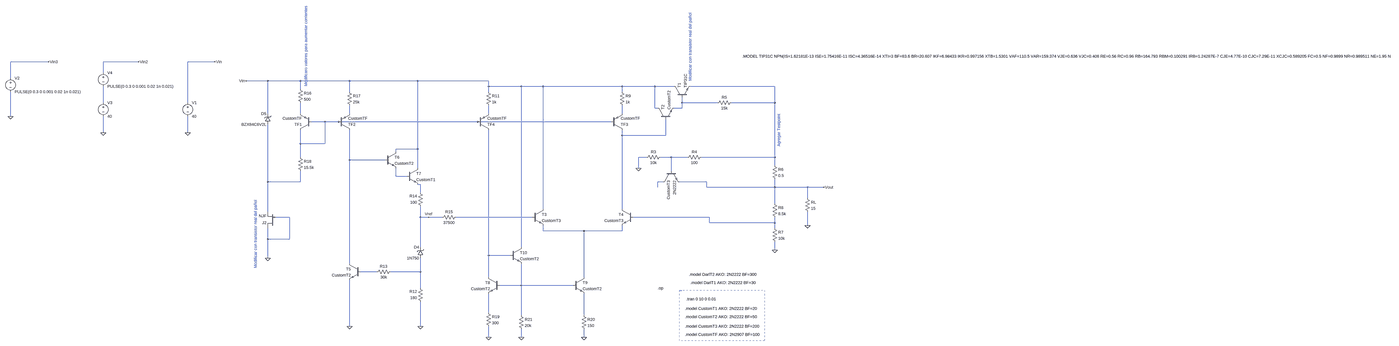
[diagram p0: schematic TP1_G6.asc, whole sheet]
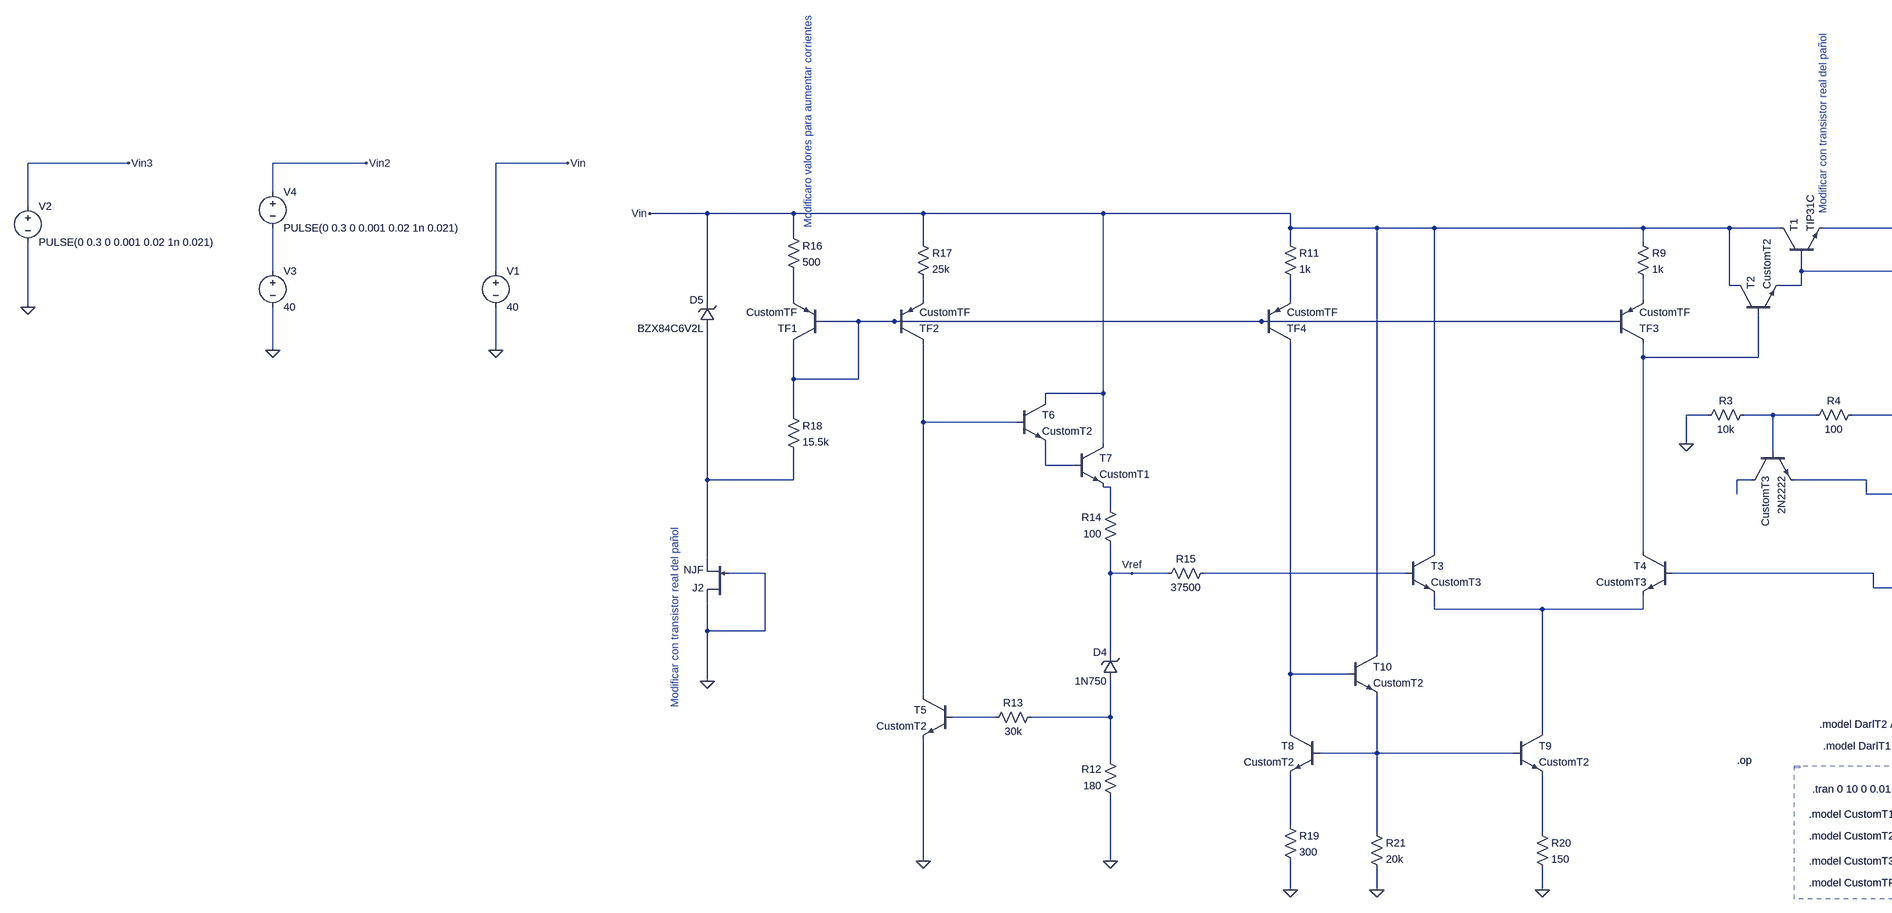
[diagram p1: schematic TP1_G6.asc, part, row 1 of 1, column 1 of 2]
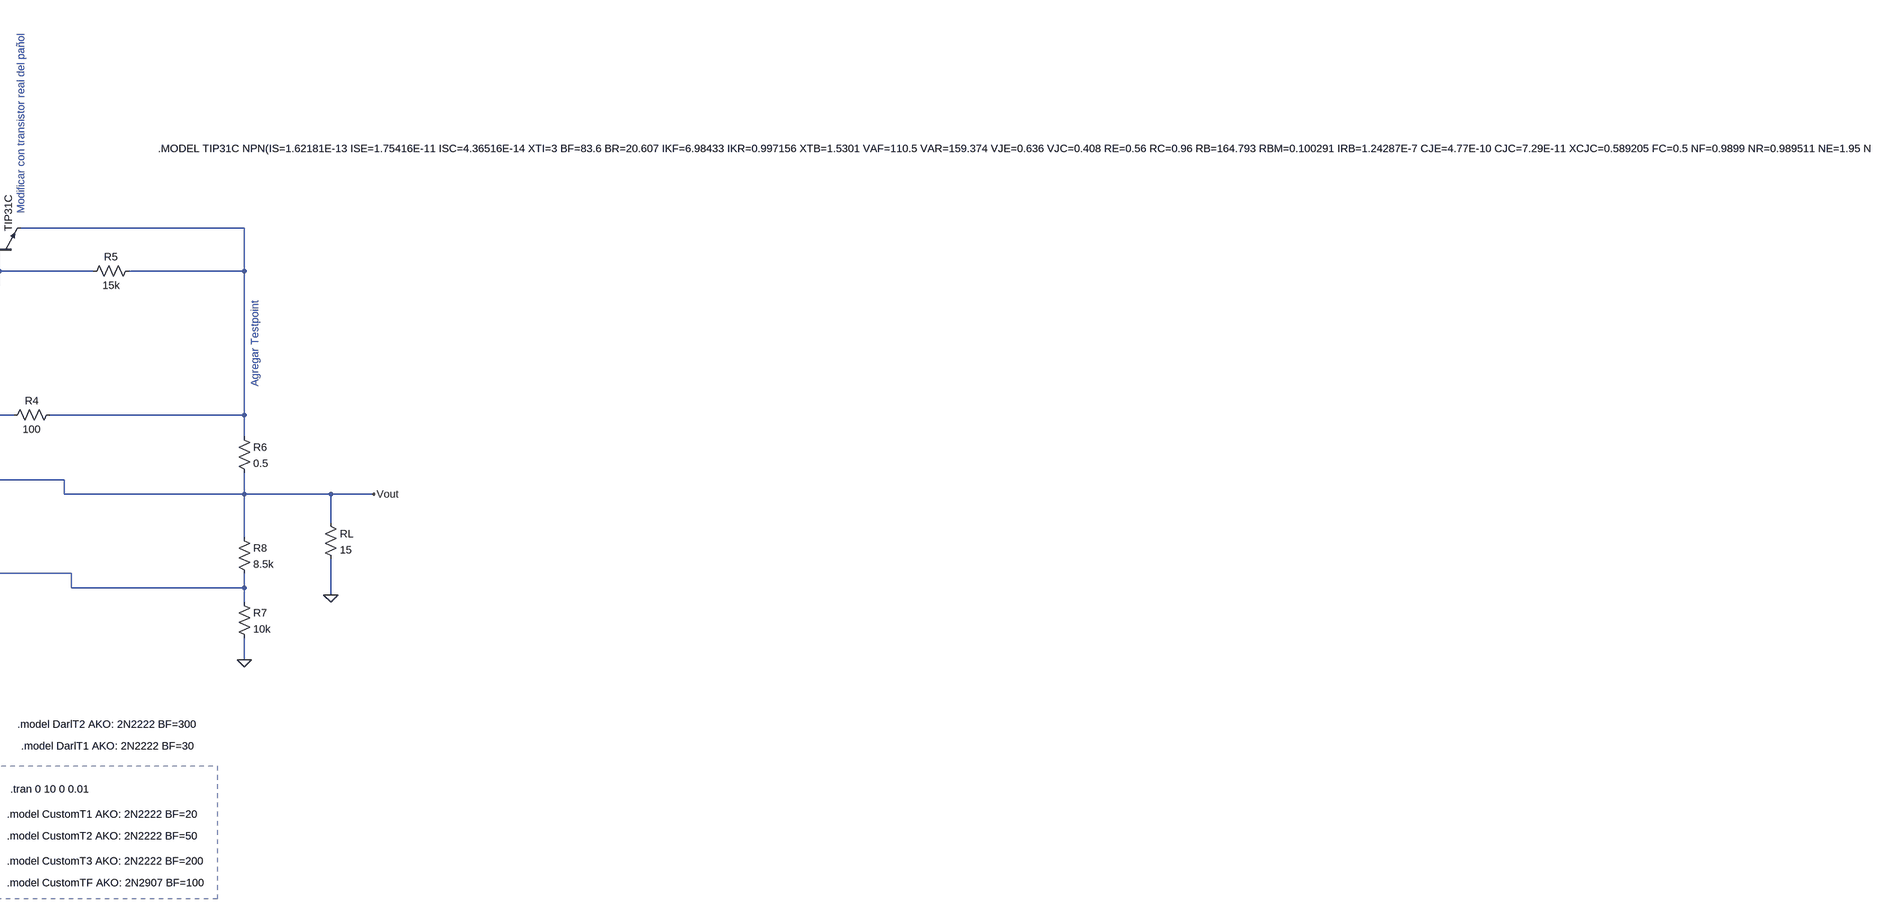
[diagram p2: schematic TP1_G6.asc, part, row 1 of 1, column 2 of 2]
TP1_G6.asc, the LTspice schematic file:
Version 4
SHEET 1 5960 1536
WIRE -3728 -224 -3952 -224
WIRE -3200 -224 -3408 -224
WIRE -2704 -224 -2912 -224
WIRE -3408 -160 -3408 -224
WIRE -3952 -128 -3952 -224
WIRE -2112 -112 -2240 -112
WIRE -1920 -112 -2112 -112
WIRE -1632 -112 -1920 -112
WIRE -1232 -112 -1632 -112
WIRE -816 -112 -1232 -112
WIRE -816 -80 -816 -112
WIRE -624 -80 -816 -80
WIRE -496 -80 -624 -80
WIRE -32 -80 -496 -80
WIRE 160 -80 -32 -80
WIRE 272 -80 160 -80
WIRE 864 -80 368 -80
WIRE -1920 -64 -1920 -112
WIRE -1632 -48 -1632 -112
WIRE -816 -48 -816 -80
WIRE -32 -48 -32 -80
WIRE -3408 16 -3408 -80
WIRE -2912 16 -2912 -224
WIRE 320 16 320 -16
WIRE 528 16 320 16
WIRE 864 16 864 -80
WIRE 864 16 608 16
WIRE 160 48 160 -80
WIRE 176 48 160 48
WIRE 320 48 320 16
WIRE 320 48 272 48
WIRE -2112 80 -2112 -112
WIRE -1920 80 -1920 16
WIRE -1632 80 -1632 32
WIRE -816 80 -816 32
WIRE -32 80 -32 32
WIRE -3952 96 -3952 -48
WIRE -1776 128 -1856 128
WIRE -1696 128 -1776 128
WIRE -880 128 -1696 128
WIRE -96 128 -880 128
WIRE -3408 192 -3408 96
WIRE -2912 192 -2912 96
WIRE -32 208 -32 176
WIRE 224 208 224 112
WIRE 224 208 -32 208
WIRE -1920 256 -1920 176
WIRE -1776 256 -1776 128
WIRE -1776 256 -1920 256
WIRE -1232 288 -1232 -112
WIRE -1232 288 -1360 288
WIRE -1360 304 -1360 288
WIRE -1920 336 -1920 256
WIRE 112 336 64 336
WIRE 256 336 192 336
WIRE 352 336 256 336
WIRE 864 336 864 16
WIRE 864 336 432 336
WIRE -1632 352 -1632 176
WIRE -1424 352 -1632 352
WIRE 864 384 864 336
WIRE -1232 400 -1232 288
WIRE 64 400 64 336
WIRE 256 416 256 336
WIRE -1360 448 -1360 400
WIRE -1296 448 -1360 448
WIRE -2112 480 -2112 144
WIRE -1920 480 -1920 416
WIRE -1920 480 -2112 480
WIRE 208 480 176 480
WIRE 464 480 304 480
WIRE -1216 496 -1232 496
WIRE 176 512 176 480
WIRE 464 512 464 480
WIRE 864 512 864 464
WIRE 864 512 464 512
WIRE 1056 512 864 512
WIRE 1152 512 1056 512
WIRE -1216 544 -1216 496
WIRE 1056 576 1056 512
WIRE 864 608 864 512
WIRE -496 640 -496 -80
WIRE -32 640 -32 208
WIRE -2112 656 -2112 480
WIRE -1984 688 -2064 688
WIRE -1216 688 -1216 624
WIRE -1168 688 -1216 688
WIRE -1088 688 -1168 688
WIRE -560 688 -1008 688
WIRE 480 688 32 688
WIRE 480 720 480 688
WIRE 864 720 864 688
WIRE 864 720 480 720
WIRE 1056 736 1056 656
WIRE 864 752 864 720
WIRE -496 768 -496 736
WIRE -256 768 -496 768
WIRE -32 768 -32 736
WIRE -32 768 -256 768
WIRE -2112 816 -2112 752
WIRE -1984 816 -1984 688
WIRE -1984 816 -2112 816
WIRE -1216 864 -1216 688
WIRE -624 864 -624 -80
WIRE 864 880 864 832
WIRE -816 912 -816 176
WIRE -688 912 -816 912
WIRE -2112 928 -2112 816
WIRE -1632 960 -1632 352
WIRE -1472 1008 -1568 1008
WIRE -1216 1008 -1216 928
WIRE -1216 1008 -1392 1008
WIRE -816 1040 -816 912
WIRE -256 1040 -256 768
WIRE -624 1088 -624 960
WIRE -624 1088 -752 1088
WIRE -320 1088 -624 1088
WIRE -1216 1104 -1216 1008
WIRE -816 1248 -816 1136
WIRE -624 1264 -624 1088
WIRE -256 1264 -256 1136
WIRE -1632 1328 -1632 1056
WIRE -1216 1328 -1216 1184
WIRE -816 1392 -816 1328
WIRE -624 1392 -624 1344
WIRE -256 1392 -256 1344
FLAG 1056 736 0
FLAG 864 880 0
FLAG 64 400 0
FLAG -2912 192 0
FLAG 1152 512 Vout
FLAG -1216 1328 0
FLAG -1632 1328 0
FLAG -2112 928 0
FLAG -816 1392 0
FLAG -256 1392 0
FLAG -624 1392 0
FLAG -2704 -224 Vin
FLAG -3408 192 0
FLAG -3200 -224 Vin2
FLAG -2240 -112 Vin
FLAG -1168 688 Vref
FLAG -3952 96 0
FLAG -3728 -224 Vin3
DATAFLAG 464 -80 "$"
DATAFLAG 176 208 "$"
DATAFLAG 240 -80 "$"
SYMBOL npn 176 112 R270
SYMATTR InstName T2
SYMATTR Value CustomT2
SYMBOL npn 272 -16 R270
SYMATTR InstName T1
SYMATTR Value TIP31C
SYMBOL npn 208 416 M90
SYMATTR InstName CustomT3
SYMATTR Value 2N2222
SYMBOL npn 32 640 M0
SYMATTR InstName T4
SYMATTR Value CustomT3
SYMBOL res 624 0 R90
WINDOW 0 0 56 VBottom 2
WINDOW 3 32 56 VTop 2
SYMATTR InstName R5
SYMATTR Value 15k
SYMBOL res 448 320 R90
WINDOW 0 0 56 VBottom 2
WINDOW 3 32 56 VTop 2
SYMATTR InstName R4
SYMATTR Value 100
SYMBOL res 208 320 R90
WINDOW 0 0 56 VBottom 2
WINDOW 3 32 56 VTop 2
SYMATTR InstName R3
SYMATTR Value 10k
SYMBOL res 848 368 R0
SYMATTR InstName R6
SYMATTR Value 0.5
SYMBOL res 848 592 R0
SYMATTR InstName R8
SYMATTR Value 8.5k
SYMBOL res 1040 560 R0
SYMATTR InstName RL
SYMATTR Value 15
SYMBOL res 848 736 R0
SYMATTR InstName R7
SYMATTR Value 10k
SYMBOL voltage -2912 0 R0
SYMATTR InstName V1
SYMATTR Value 40
SYMBOL npn -560 640 R0
SYMATTR InstName T3
SYMATTR Value CustomT3
SYMBOL zener -1200 928 R180
WINDOW 0 24 64 Left 2
WINDOW 3 24 0 Left 2
SYMATTR InstName D4
SYMATTR Value 1N750
SYMBOL res -1200 1200 R180
WINDOW 0 36 76 Left 2
WINDOW 3 36 40 Left 2
SYMATTR InstName R12
SYMATTR Value 180
SYMBOL res -1488 1024 R270
WINDOW 0 32 56 VTop 2
WINDOW 3 0 56 VBottom 2
SYMATTR InstName R13
SYMATTR Value 30k
SYMBOL npn -1568 960 M0
SYMATTR InstName T5
SYMATTR Value CustomT2
SYMBOL npn -1424 304 R0
SYMATTR InstName T6
SYMATTR Value CustomT2
SYMBOL npn -1296 400 R0
SYMATTR InstName T7
SYMATTR Value CustomT1
SYMBOL res -1200 640 R180
WINDOW 0 36 76 Left 2
WINDOW 3 36 40 Left 2
SYMATTR InstName R14
SYMATTR Value 100
SYMBOL res -1104 704 R270
WINDOW 0 32 56 VTop 2
WINDOW 3 0 56 VBottom 2
SYMATTR InstName R15
SYMATTR Value 37500
SYMBOL zener -2096 144 R180
WINDOW 0 24 64 Left 2
WINDOW 3 24 0 Left 2
SYMATTR InstName D5
SYMATTR Value BZX84C6V2L
SYMBOL pnp -1856 176 R180
SYMATTR InstName TF1
SYMATTR Value CustomTF
SYMBOL pnp -1696 176 M180
SYMATTR InstName TF2
SYMATTR Value CustomTF
SYMBOL res -1936 -80 R0
SYMATTR InstName R16
SYMATTR Value 500
SYMBOL res -1648 -64 R0
SYMATTR InstName R17
SYMATTR Value 25k
SYMBOL res -1936 320 R0
SYMATTR InstName R18
SYMATTR Value 15.5k
SYMBOL njf -2064 752 R180
SYMATTR InstName J2
SYMBOL pnp -96 176 M180
SYMATTR InstName TF3
SYMATTR Value CustomTF
SYMBOL res -48 -64 R0
SYMATTR InstName R9
SYMATTR Value 1k
SYMBOL pnp -880 176 M180
SYMATTR InstName TF4
SYMATTR Value CustomTF
SYMBOL res -832 -64 R0
SYMATTR InstName R11
SYMATTR Value 1k
SYMBOL npn -752 1040 M0
SYMATTR InstName T8
SYMATTR Value CustomT2
SYMBOL npn -320 1040 R0
SYMATTR InstName T9
SYMATTR Value CustomT2
SYMBOL res -832 1232 R0
SYMATTR InstName R19
SYMATTR Value 300
SYMBOL res -272 1248 R0
SYMATTR InstName R20
SYMATTR Value 150
SYMBOL npn -688 864 R0
SYMATTR InstName T10
SYMATTR Value CustomT2
SYMBOL res -640 1248 R0
SYMATTR InstName R21
SYMATTR Value 20k
SYMBOL voltage -3408 0 R0
SYMATTR InstName V3
SYMATTR Value 40
SYMBOL voltage -3408 -176 R0
SYMATTR InstName V4
SYMATTR Value PULSE(0 0.3 0 0.001 0.02 1n 0.021)
SYMBOL voltage -3952 -144 R0
SYMATTR InstName V2
SYMATTR Value PULSE(0 0.3 0 0.001 0.02 1n 0.021)
TEXT 336 1224 Left 2 !.model CustomT1 AKO: 2N2222 BF=20
TEXT 336 1272 Left 2 !.model CustomT2 AKO: 2N2222 BF=50
TEXT 336 1328 Left 2 !.model CustomT3 AKO: 2N2222 BF=200
TEXT 344 1168 Left 2 !.tran 0 10 0 0.01
TEXT 336 1376 Left 2 !.model CustomTF AKO: 2N2907 BF=100
TEXT 360 1024 Left 2 !.model DarlT2 AKO: 2N2222 BF=300
TEXT 368 1072 Left 2 !.model DarlT1 AKO: 2N2222 BF=30
TEXT 888 80 VRight 2 ;Agregar Testpoint
TEXT -1888 -80 VLeft 2 ;Modificaro valores para aumentar corrientes
TEXT 368 -112 VLeft 2 ;Modificar con transistor real del pañol
TEXT -2184 584 VRight 2 ;Modificar con transistor real del pañol
TEXT 672 -256 Left 2 !.MODEL TIP31C NPN(IS=1.62181E-13 ISE=1.75416E-11 ISC=4.36516E-14 XTI=3 BF=83.6 BR=20.607 IKF=6.98433 IKR=0.997156 XTB=1.5301 VAF=110.5 VAR=159.374 VJE=0.636 VJC=0.408 RE=0.56 RC=0.96 RB=164.793 RBM=0.100291 IRB=1.24287E-7 CJE=4.77E-10 CJC=7.29E-11 XCJC=0.589205 FC=0.5 NF=0.9899 NR=0.989511 NE=1.95 NC=1.014 MJE=0.327 MJC=0.339 TF=2.3733E-8 TR=1.0000E-8 ITF=1 VTF=10 XTF=10 EG=1.1605 VCEO=100 ICRATING=3 MFG=TEXAS)
TEXT 176 1104 Left 2 !.op
RECTANGLE Normal 316 1120 304 1116 2
RECTANGLE Normal 804 1412 304 1116 1

The netlist it stands for:
* TP1_G6.asc
Q§T2 Vin N009 N003 0 CustomT2
Q§T1 Vin N003 N001 0 TIP31C
Q§CustomT3 N014 N010 Vout 0 2N2222
Q§T4 N009 N017 N018 0 CustomT3
R5 N001 N003 15k
R4 N001 N010 100
R3 N010 0 10k
R6 N001 Vout 0.5
R8 Vout N017 8.5k
RL Vout 0 15
R7 N017 0 10k
V1 Vin 0 40
Q§T3 Vin N016 N018 0 CustomT3
D4 N021 Vref 1N750
R12 0 N021 180
R13 N020 N021 30k
Q§T5 N011 N020 0 0 CustomT2
Q§T6 Vin N011 N012 0 CustomT2
Q§T7 Vin N012 N015 0 CustomT1
R14 Vref N015 100
R15 Vref N016 37500
D5 N013 Vin BZX84C6V2L
Q§TF1 N008 N008 N004 0 CustomTF
Q§TF2 N011 N008 N005 0 CustomTF
R16 Vin N004 500
R17 Vin N005 25k
R18 N008 N013 15.5k
J2 0 0 N013 NJF
Q§TF3 N009 N008 N007 0 CustomTF
R9 Vin N007 1k
Q§TF4 N019 N008 N006 0 CustomTF
R11 Vin N006 1k
Q§T8 N019 N022 N023 0 CustomT2
Q§T9 N018 N022 N024 0 CustomT2
R19 N023 0 300
R20 N024 0 150
Q§T10 Vin N019 N022 0 CustomT2
R21 N022 0 20k
V3 N002 0 40
V4 Vin2 N002 PULSE(0 0.3 0 0.001 0.02 1n 0.021)
V2 Vin3 0 PULSE(0 0.3 0 0.001 0.02 1n 0.021)
.model D D
.lib standard.dio
.model NPN NPN
.model PNP PNP
.lib standard.bjt
.model NJF NJF
.model PJF PJF
.lib standard.jft
.model CustomT1 AKO: 2N2222 BF=20
.model CustomT2 AKO: 2N2222 BF=50
.model CustomT3 AKO: 2N2222 BF=200
.tran 0 10 0 0.01
.model CustomTF AKO: 2N2907 BF=100
.model DarlT2 AKO: 2N2222 BF=300
.model DarlT1 AKO: 2N2222 BF=30
* Agregar Testpoint
* Modificaro valores para aumentar corrientes
* Modificar con transistor real del pañol
* Modificar con transistor real del pañol
.MODEL TIP31C NPN(IS=1.62181E-13 ISE=1.75416E-11 ISC=4.36516E-14 XTI=3 BF=83.6 BR=20.607 IKF=6.98433 IKR=0.997156 XTB=1.5301 VAF=110.5 VAR=159.374 VJE=0.636 VJC=0.408 RE=0.56 RC=0.96 RB=164.793 RBM=0.100291 IRB=1.24287E-7 CJE=4.77E-10 CJC=7.29E-11 XCJC=0.589205 FC=0.5 NF=0.9899 NR=0.989511 NE=1.95 NC=1.014 MJE=0.327 MJC=0.339 TF=2.3733E-8 TR=1.0000E-8 ITF=1 VTF=10 XTF=10 EG=1.1605 VCEO=100 ICRATING=3 MFG=TEXAS)
.op
.backanno
.end